# Altium schematic sheet Conectors.SchDoc
size A4; SheetNumber: 3; SheetTotal: 3
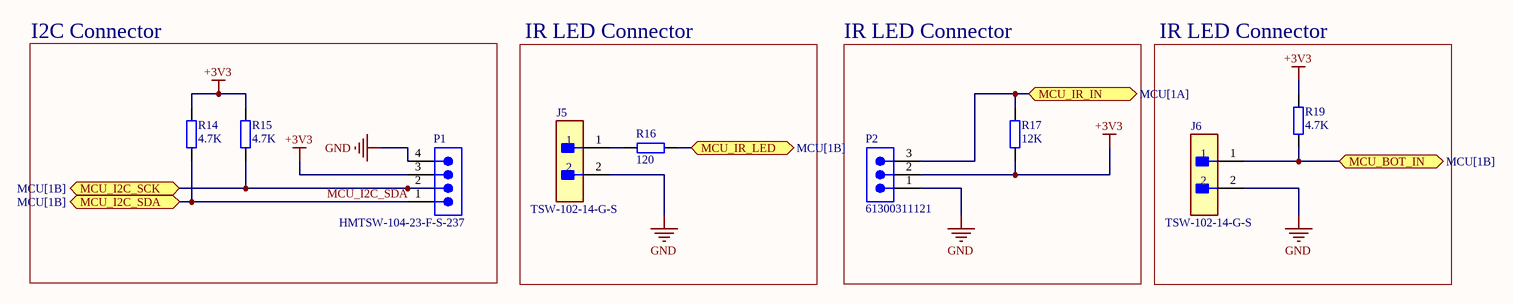
[diagram p0: Conectors.SchDoc]

## Parts
J5  TSW-102-14-G-S  [FP-TSW-102-14-G-S-MFG]
J6  TSW-102-14-G-S  [FP-TSW-102-14-G-S-MFG]
P1  HMTSW-104-23-F-S-237  [SMTC-HMTSW-104-23-X-S-237]
P2  61300311121  [61300311121]
R14  4.7K  [RES_0603]
R15  4.7K  [RES_0603]
R16  120  [RES_0603]
R17  12K  [RES_0603]
R19  4.7K  [RES_0603]

## Blocks framed on the sheet
I2C Connector: P1 R14 R15
IR LED Connector: J5 R16
IR LED Connector: P2 R17
IR LED Connector: J6 R19

## Ports
MCU_BOT_IN (bidir, see MCU[1B]), MCU_I2C_SCK (bidir, see MCU[1B]), MCU_I2C_SDA (bidir, see MCU[1B]), MCU_IR_IN (bidir, see MCU[1A]), MCU_IR_LED (bidir, see MCU[1B])

## Nets
+3V3: P1.3 P2.2 R14.2 R15.2 R17.1 R19.1
GND: J5.2 J6.2 P1.4 P2.1
MCU_BOT_IN: J6.1 R19.2 ; port MCU_BOT_IN
MCU_I2C_SCK: P1.2 R15.1 ; port MCU_I2C_SCK
MCU_I2C_SDA: P1.1 R14.1 ; port MCU_I2C_SDA
MCU_IR_IN: P2.3 R17.2 ; port MCU_IR_IN
MCU_IR_LED: R16.1 ; port MCU_IR_LED
NetJ5_1: J5.1 R16.2

## Library data of the parts
J5 J6 = CMP-02766-001740-1: CONN HEADER VERT 2POS 2.54MM; Number of Positions: 2; Max Current Rating: 7.6A; Gender: Male; Max Voltage Rating (AC): 550V; Contact Mating Length: 0.32inch; REACH SVHC: No SVHC; Width: 2.54mm; Insulation Material: PBT; Contact Shape: Square; Contact Plating: Gold; Min Operating Temperature: -55°C; Contact Material: Bronze; Color: Black; Number of Contacts: 2; Housing Material: Polyester; Orientation: Straight; Flammability Rating: UL94 V-0; Max Operating Temperature: 125°C; Contact Type: Male Pin; Radiation Hardening: No; Termination: Solder; RoHS Compliant: Yes; Lead Free: Lead Free; Fastening Type: Pull; Pitch: 2.54mm; Number of Rows: 1; Series: TSW; Insulation Color: Black; Package Quantity: 1; Connector Type: Header; Length: 5.08mm; Contact Finish - Mating: GOLD; Mount: Through Hole; Housing Color: Black; Depth: 2.54mm; Packaging: Bulk
P1 = CMP-1024-00021-1: Modified .025" SQ Post Header, Through-hole, Vertical, -55 to 125 degC, 2.54 mm Pitch, 4-Pin, Male, RoHS; Manufacturer: Samtec; Pitch: 2.54 mm; PackageReference: HMTSW-104-23-X-S-237; ComponentLink2URL: http://www.samtec.com/documents/webfiles/pdf/HMTSW.PDF; ComponentLink3Description: Package Specification; PartNumber: HMTSW-104-23-F-S-237; RoHS: True; ComponentLink2Description: Datasheet; Temperature Range: -55 to 125 degC; ComponentLink1Description: Manufacturer URL; DatasheetVersion: F-214; PackageDescription: Assembly .025 [.64] SQ. Post Hi-Temp Terminal Strip; Orientation: Vertical; PackageVersion: AL, 3/1987; Mounting Technology: Through-hole; ComponentLink1URL: http://www.samtec.com; ComponentLink3URL: http://www.samtec.com/documents/webfiles/cpdf/HMTSW-XXX-XX-X-X-XXXX-XX-XX-MKT1.pdf
P2 = CMP-1502-01062-3: NexarPartId: 32855521; Current Rating: 3A; Voltage Rating: 250V; Number of Positions: 3; Pitch: 2.54mm; Contact Resistance: 20mΩ; Connector Type: Male Pin; Gender: Male; REACH SVHC: Unknown; Packaging: Bulk; Contact Material: Copper; Min Operating Temperature: -40°C; Number of Rows: 1; Orientation: Vertical; RoHS: Compliant; Contact Plating: Gold; Max Operating Temperature: 105°C; Mount: Through Hole; Height: 8.94mm; Operating Supply Voltage: 250V; Number of Pins: 3; Contact Mating Length: 5.9944mm; Number of Contacts: 3; Color: Black; Lead Free: Lead Free; Lead Pitch: 2.54mm; Termination: Solder
R14-R17 R19 = RES_0603: Resistor SMD 0603; Manufacturer: *; Manufacturer Part Number: *; Distributor Link: *; LCSC: *